# EAGLE schematic Pure ADSR (EAGLE 8.7.0)

## Sheet 1 of 3
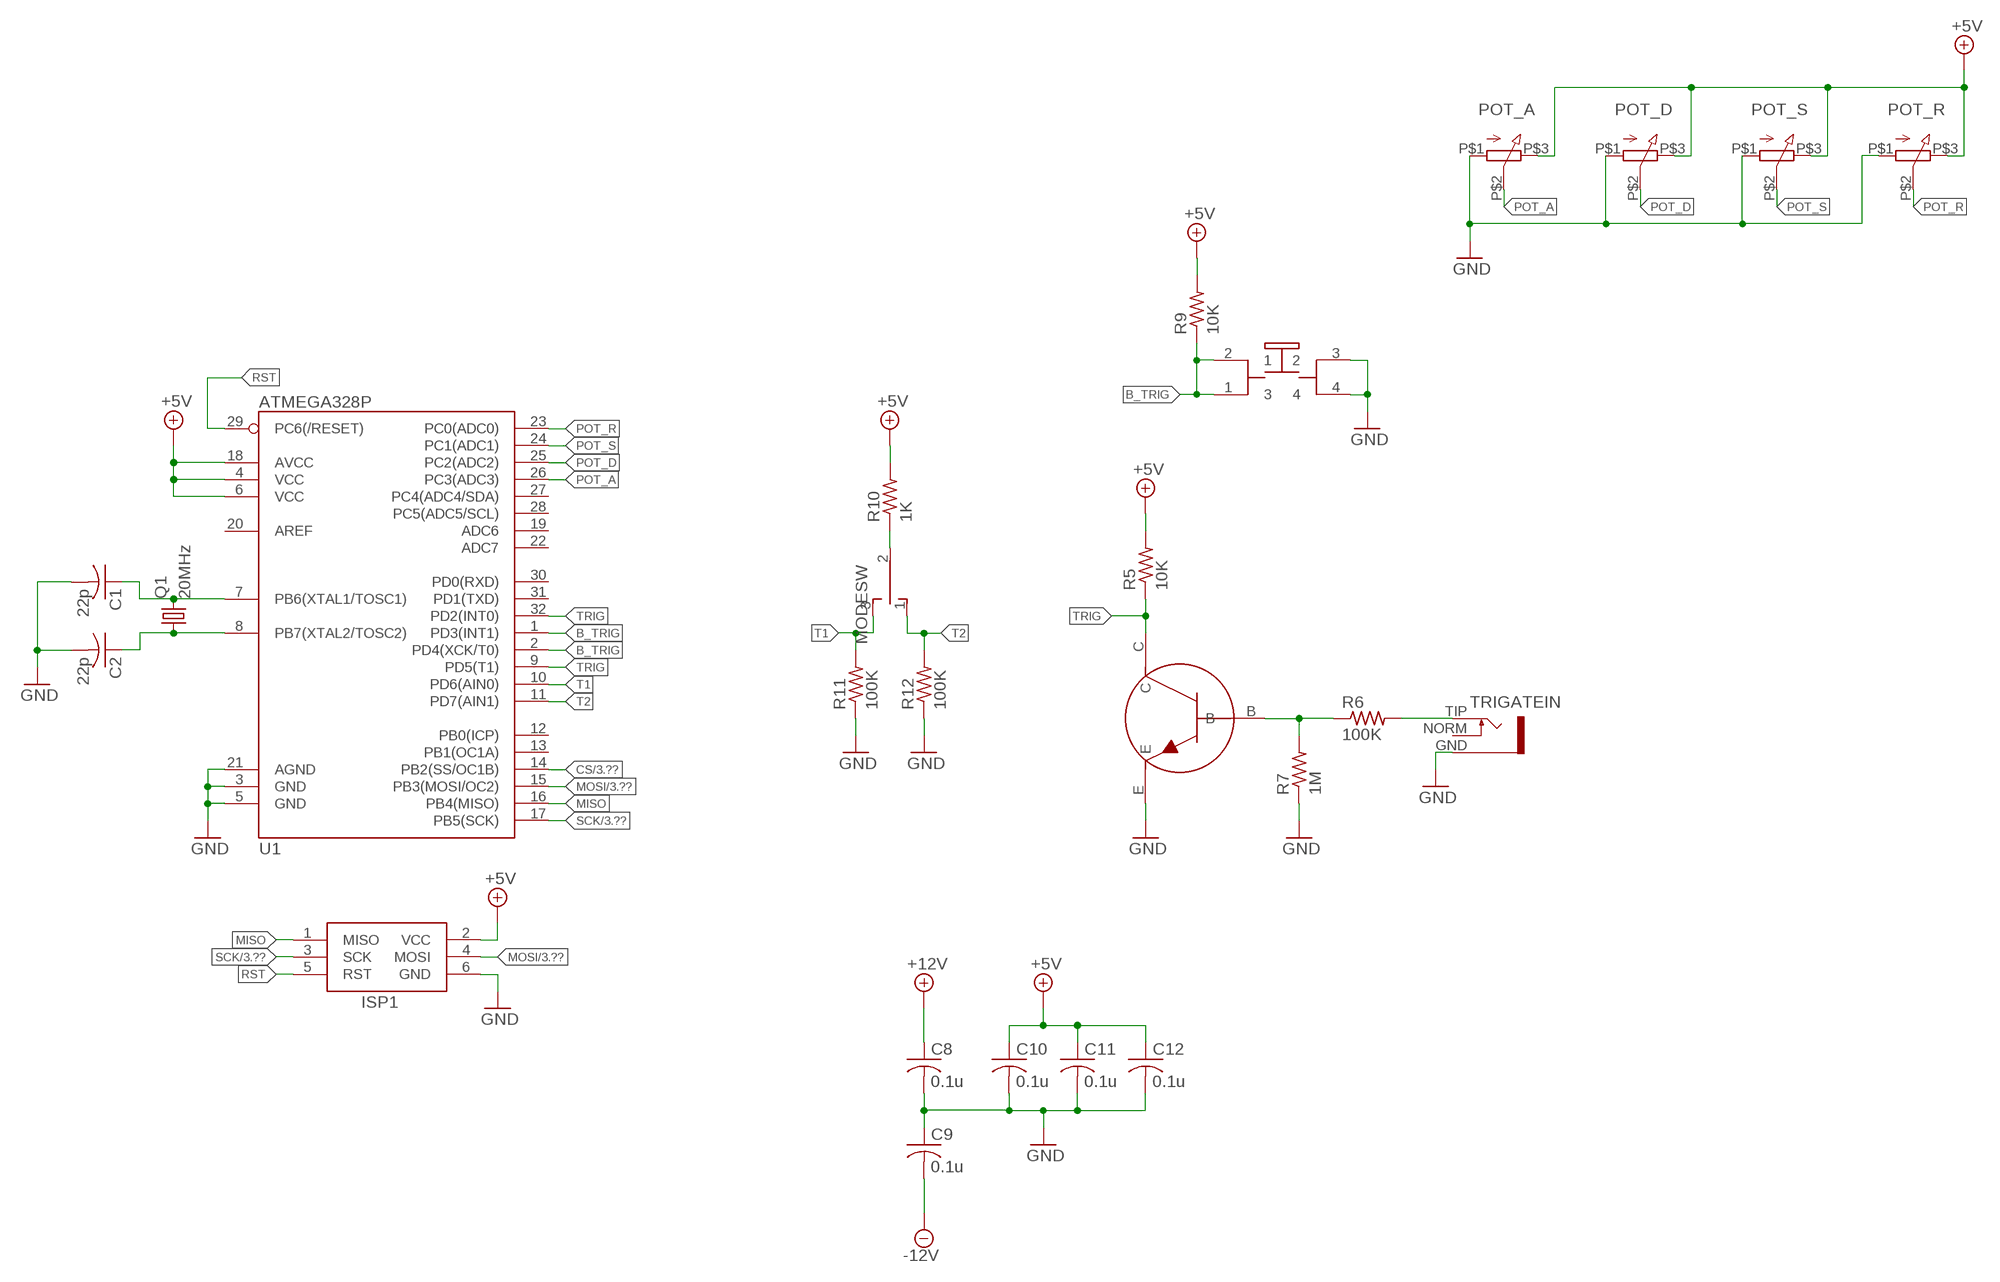
[diagram p0: schematic, sheet 1]

### Parts
BUT  PB6149L-5  SWITCH_PUSHBUTTON_LED  [PB6149L]
C1  22p  C-USC0805K  [C0805K]
C2  22p  C-USC0805K  [C0805K]
C8  0.1u  C-USC0805K  [C0805K]
C9  0.1u  C-USC0805K  [C0805K]
C10  0.1u  C-USC0805K  [C0805K]
C11  0.1u  C-USC0805K  [C0805K]
C12  0.1u  C-USC0805K  [C0805K]
ISP1  AVRISP-6  [AVRISP]
MODESW  TOGGLE_ON_OFF_ON  [TOGGLE_ON_OFF_ON]
POT_A  Q-POT  [Q-POT]
POT_D  Q-POT  [Q-POT]
POT_R  Q-POT  [Q-POT]
POT_S  Q-POT  [Q-POT]
Q1  20MHz  CRYSTALHC49UP  [HC49UP]
R5  10K  R-US_R0805  [R0805]
R6  100K  R-US_R0805  [R0805]
R7  1M  R-US_R0805  [R0805]
R9  10K  R-US_R0805  [R0805]
R10  1K  R-US_R0805  [R0805]
R11  100K  R-US_R0805  [R0805]
R12  100K  R-US_R0805  [R0805]
T1  2N3904  TRANSISTOR_MMBT3904  [TRANSISTOR_SINGLE_N-TYPE]
TRIGATEIN  S_JACK  [S_JACK]
U1  ATMEGA328P  ATMEGA328_SMT  [TQFP32-08]

### Nets
+5V: C10.1 C11.1 C12.1 ISP1.2(VCC) POT_A.P$3 POT_D.P$3 POT_R.P$3 POT_S.P$3 R5.2 R9.2 R10.2 U1.4(VCC) U1.6(VCC) U1.18(AVCC) ; also sheet 2,3
+12V: C8.1 ; also sheet 2
-12V: C9.2 ; also sheet 2
B_TRIG: BUT.1 BUT.2 R9.1 U1.1(PD3(INT1)) U1.2(PD4(XCK/T0))
CS: U1.14(PB2(SS/OC1B)) ; also sheet 3
GND: BUT.3 BUT.4 C1.2 C2.2 C8.2 C9.1 C10.2 C11.2 C12.2 ISP1.6(GND) POT_A.P$1 POT_D.P$1 POT_R.P$1 POT_S.P$1 R7.1 R11.1 R12.1 T1.E TRIGATEIN.GND U1.3(GND) U1.5(GND) U1.21(AGND) ; also sheet 2,3
MISO: ISP1.1(MISO) U1.16(PB4(MISO))
MOSI: ISP1.4(MOSI) U1.15(PB3(MOSI/OC2)) ; also sheet 3
N$1: C1.1 Q1.2 U1.7(PB6(XTAL1/TOSC1))
N$2: C2.1 Q1.1 U1.8(PB7(XTAL2/TOSC2))
N$12: MODESW.2(P) R10.1
N$15: R6.1 R7.2 T1.B
N$18: R6.2 TRIGATEIN.TIP
POT_A: POT_A.P$2 U1.26(PC3(ADC3))
POT_D: POT_D.P$2 U1.25(PC2(ADC2))
POT_R: POT_R.P$2 U1.23(PC0(ADC0))
POT_S: POT_S.P$2 U1.24(PC1(ADC1))
RST: ISP1.5(RST) U1.29(PC6(/RESET))
SCK: ISP1.3(SCK) U1.17(PB5(SCK)) ; also sheet 3
T1: MODESW.3(S) R11.2 U1.10(PD6(AIN0))
T2: MODESW.1(O) R12.2 U1.11(PD7(AIN1))
TRIG: R5.1 T1.C U1.9(PD5(T1)) U1.32(PD2(INT0))
Unconnected: TRIGATEIN.NORM U1.12(PB0(ICP)) U1.13(PB1(OC1A)) U1.19(ADC6) U1.20(AREF) U1.22(ADC7) U1.27(PC4(ADC4/SDA)) U1.28(PC5(ADC5/SCL)) U1.30(PD0(RXD)) U1.31(PD1(TXD))

## Sheet 2 of 3: Power
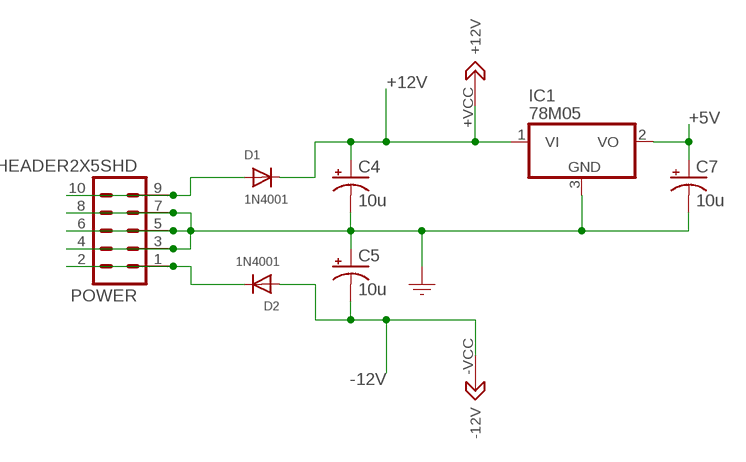
[diagram p1: schematic, sheet 2]

### Parts
C4  10u  CAPACITOR_POL-US153CLV-0505  [153CLV-0505]
C5  10u  CAPACITOR_POL-US153CLV-0505  [153CLV-0505]
C7  10u  CAPACITOR_POL-US153CLV-0505  [153CLV-0505]
D1  1N4001  DIODESMA  [SMADIODE]
D2  1N4001  DIODESMA  [SMADIODE]
IC1  78M05  VOLTAGE_REG_POS05DT  [TO252]
POWER  HEADER2X5SHD  [2X5-SHROUDED]
U2  DUAL_OPAMP  [DUAL_OPAMP]

### Nets
+5V: C7.+ IC1.2(VO) ; also sheet 1,3
+12V: C4.+ D1.C IC1.1(VI) U2.+VCC(+12V) ; also sheet 1
-12V: C5.- D2.A U2.-VCC(-12V) ; also sheet 1
GND: C4.- C5.+ C7.- IC1.3(GND) POWER.3 POWER.4 POWER.5 POWER.6 POWER.7 POWER.8 ; also sheet 1,3
N$9: D1.A POWER.9 POWER.10
N$10: D2.C POWER.1 POWER.2

## Sheet 3 of 3: DAC
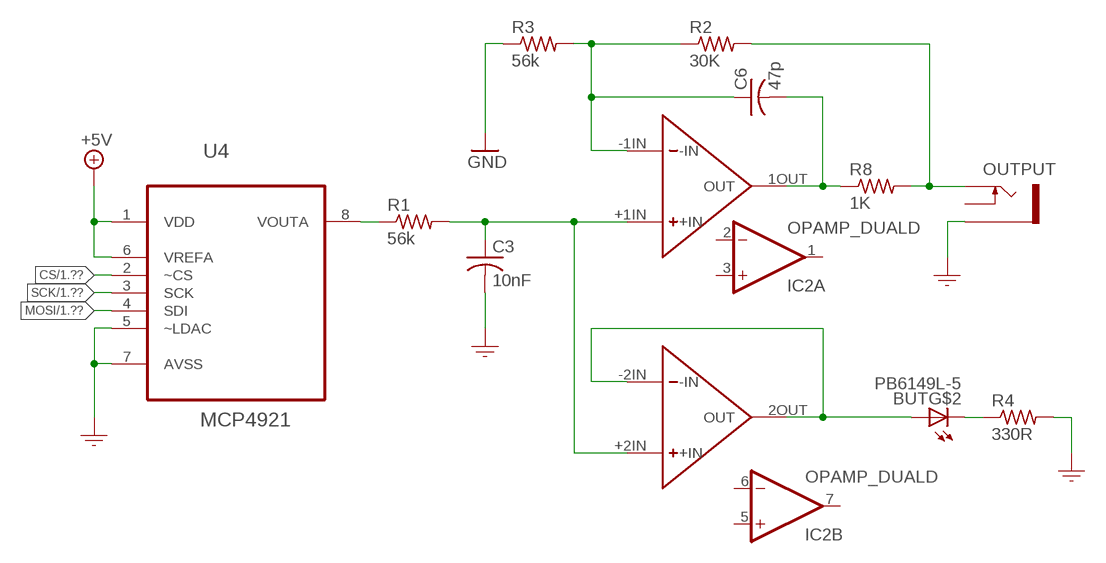
[diagram p2: schematic, sheet 3]

### Parts
C3  10nF  CAPACITOR-USC0805  [C0805]
C6  47p  CAPACITOR-USC0805  [C0805]
IC2  OPAMP_DUALD  [SO08]
OUTPUT  SOCKET_MONO_3.5MMPJ301M-12  [PJ301M-12]
R1  56k  RESISTOR_USR0805  [R0805]
R2  30K  RESISTOR_USR0805  [R0805]
R3  56k  RESISTOR_USR0805  [R0805]
R4  330R  RESISTOR_USR0805  [R0805]
R8  1K  RESISTOR_USR0805  [R0805]
U4  MCP4921  DAC_SINGLE_12B_MCP4921  [SOIC8]

### Nets
+5V: U4.1(VDD) U4.6(VREFA) ; also sheet 1,2
CS: U4.2(~CS) ; also sheet 1
GND: C3.2 OUTPUT.GND(SLEEVE) R3.1 R4.2 U4.5(~LDAC) U4.7(AVSS) ; also sheet 1,2
MOSI: U4.4(SDI) ; also sheet 1
N$3: R1.1 U4.8(VOUTA)
N$4: C3.1 R1.2 U2.+1IN(+IN) U2.+2IN(+IN)
N$5: C6.1 R2.1 R3.2 U2.-1IN(-IN)
N$6: OUTPUT.TIP R2.2 R8.2
N$7: BUT.A U2.2OUT(OUT) U2.-2IN(-IN)
N$8: BUT.K(C) R4.1
N$11: C6.2 R8.1 U2.1OUT(OUT)
SCK: U4.3(SCK) ; also sheet 1
Unconnected: IC2.1(A:OUT) IC2.2(A:-IN) IC2.3(A:+IN) IC2.5(B:+IN) IC2.6(B:-IN) IC2.7(B:OUT) OUTPUT.NORM(SWITCH)

## Power pins joined to a net without a drawn wire
V+: IC2.8(P:V+)
V-: IC2.4(P:V-)

## Library data of the parts
BUT = GMSN:SWITCH_PUSHBUTTON_LED
C1 C2 C8-C12 = rcl:C-US: CAPACITOR, American symbol
C3 C6 = GMSN:CAPACITOR-US: CAPACITOR, American symbol
C4 C5 C7 = GMSN:CAPACITOR_POL-US: POLARIZED CAPACITOR, American symbol
D1 D2 = GMSN:DIODE: Diode SMADIODE - SMA Surface Mount Package 20V 1A Schottky Diode Digikey: 641-1014-6-ND DO-1N4148 - Through Hole Small Current Diode SOD-123 20V 1 A (.5mV Vf) Schottky Diode - Digikey: MBRX120TPMSCT-ND SOD-323 10V 570mA (.38mV Vf, 3ns) Schottky Diode - Digikey: ZLLS410CT-ND SOD-523 30V 30mA Schottky Diode (RB751S-40TE61) - Digikey: RB751S-40TE61CT-ND SOT23-R/W - SOT23 Package (R = Solder Paste/Reflow Ovens, W = Hand-Soldering) BAT54Film 40V 300mA - Digikey: 497-7162-1-ND
IC1 = GMSN:VOLTAGE_REG_POS: Positive VOLTAGE REGULATOR Added bigger pads to the TO-92 package
IC2 = GMSN:OPAMP_DUAL: OP AMP
ISP1 = adafruit:AVRISP: AVR ISP HEADER Standard 6 pin header for AVR programming
MODESW = INSTRUO:TOGGLE_ON_OFF_ON
OUTPUT = GMSN:SOCKET_MONO_3.5MM: 3.5 mm jack socket
POT_A POT_D POT_R POT_S = INSTRUO:Q-POT
POWER = GMSN:HEADER2X5: Header 5x2 Standard 10-pin dual row 0.1" header. Commonly used with AVR-ISP. Use with Spark Fun Electronics SKU: PRT-00778
Q1 = adafruit:CRYSTAL: CRYSTAL; OC_FARNELL: unknown; OC_NEWARK: unknown
R1-R4 R8 = GMSN:RESISTOR_US: RESISTOR, American symbol
R5-R7 R9-R12 = rcl:R-US_: RESISTOR, American symbol
T1 = INSTRUO:TRANSISTOR_MMBT3904
TRIGATEIN = INSTRUO:S_JACK
U1 = SparkFun-DigitalIC:ATMEGA328_SMT: 32-Pin Atmega328 part Commonly used on Arduino compatible boards Available in QFP and QFN packages TQFP is IC-09069 QFN is non-stock; PROD_ID: IC-09069
U2 = INSTRUO:DUAL_OPAMP
U4 = GMSN:DAC_SINGLE_12B_MCP4921